# EAGLE schematic mainProbe_ESP12_mill (EAGLE 9.1.1)
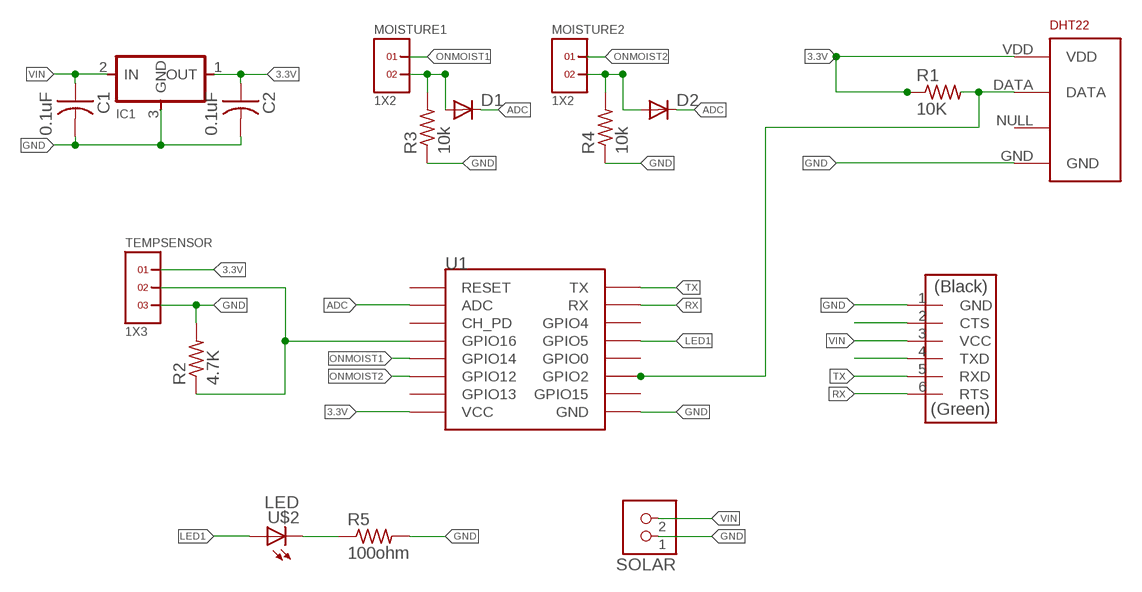
[diagram p0: schematic, sheet 1]

## Parts
C1  0.1uF  CAP-US1206  [C1206]
C2  0.1uF  CAP-US1206  [C1206]
D1  DIODESOD123  [SOD123]
D2  DIODESOD123  [SOD123]
DHT22  RHT03_DHT-22_AM2302  [RHT03_DHT-22]
IC1  REGULATORSOT23  [SOT23]
MOISTURE1  1X2  [1X2]
MOISTURE2  1X2  [1X2]
R1  10K  RES-US1206  [R1206]
R2  4.7K  RES-US1206  [R1206]
R3  10k  RES-US1206  [R1206]
R4  10k  RES-US1206  [R1206]
R5  100ohm  RES-US1206  [R1206]
SOLAR  TERM-1X02-ADAFRUIT  [3.5MMTERM]
TEMPSENSOR  1X3  [1X3]
U1  ESP12  [ESP12]
U$1  FTDI-SMD-HEADER  [1X06SMD]
U$2  LED  [LED1206]

## Nets
3.3V: C2.1 DHT22.VDD IC1.1(OUT) R1.1 TEMPSENSOR.1 U1.VCC
ADC: D1.CATHODE(C) D2.CATHODE(C) U1.ADC
GND: C1.2 C2.2 DHT22.GND IC1.3(GND) R2.2 R3.1 R4.1 R5.2 SOLAR.1 TEMPSENSOR.3 U1.GND U$1.1(GND)
LED1: U1.GPIO5 U$2.1(A)
N$2: U$1.2(CTS)
N$3: R2.1 TEMPSENSOR.2 U1.GPIO16
N$4: U$1.4(TXD)
N$5: D1.ANODE(A) MOISTURE1.2 R3.2
N$6: R5.1 U$2.2(C)
N$7: D2.ANODE(A) MOISTURE2.2 R4.2
N$8: DHT22.DATA R1.2 U1.GPIO2
ONMOIST1: MOISTURE1.1 U1.GPIO14
ONMOIST2: MOISTURE2.1 U1.GPIO12
RX: U1.RX U$1.6(RTS)
TX: U1.TX U$1.5(RXD)
VIN: C1.1 IC1.2(IN) SOLAR.2 U$1.3(VCC)
Unconnected: DHT22.NULL U1.CH_PD U1.GPIO0 U1.GPIO4 U1.GPIO13 U1.GPIO15 U1.RESET

## Library data of the parts
C1 C2 = fab:CAP-US
D1 D2 = fab:DIODE: DIODE high speed (Philips)
DHT22 = RHT03_DHT-22_AM2302:RHT03_DHT-22_AM2302: RHT03 / DHT-22 / AM2302 Packages and symbol for the RHT03 / DHT-22 relative humidity and temperature sensor. Note: The AM2302 is a wired version of the DHT-22 which typically requires less clearance and is thus provided as a separate package.; PROD_ID: SEN-10167
IC1 = fab:REGULATOR
MOISTURE1 MOISTURE2 = headers(2mm):1X2
R1-R5 = fab:RES-US: Resistor (US Symbol) Variants with postfix FAB are widened to allow the routing of internal traces
SOLAR = fab:TERM-1X02: 3.5mm terminal block, 2 positions ED555-2DS as found in the fablab inventory. Stolen from Adafruit <http://www.ladyada.net/library/pcb/eaglelibrary.html>, adapted by Zaerc.
TEMPSENSOR = headers(2mm):1X3
U1 = esp8266modules:ESP12: ESP8266 Wifi module 12
U$1 = fab:FTDI-SMD-HEADER
U$2 = fab:LED: LED